# EAGLE design ESP8266 RFID Schematic (EAGLE 9.6.2)
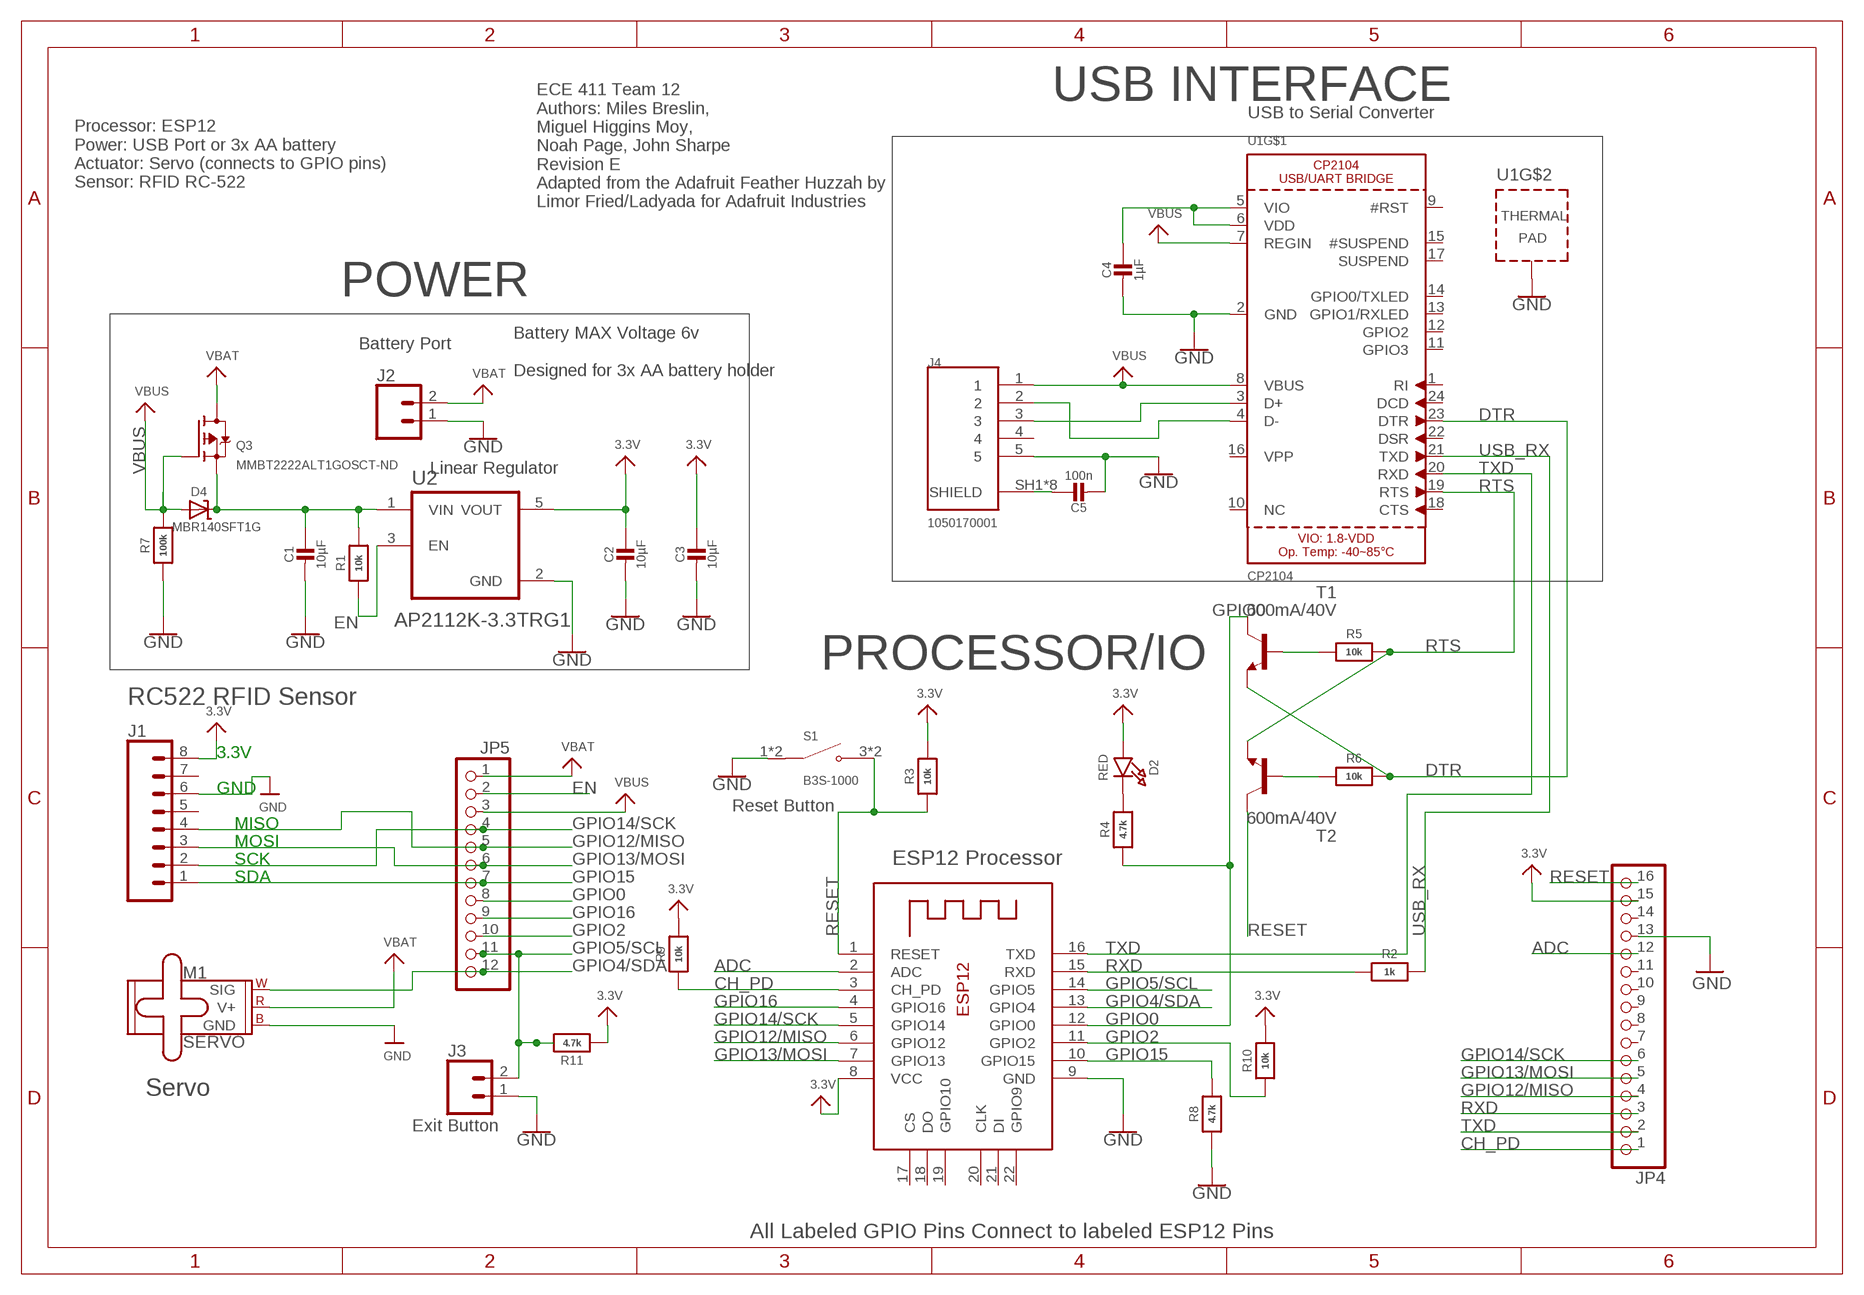
[diagram p0: schematic, sheet 1]

## Parts
C1  10µF  CAP_CERAMIC0603MINI  [0603-MINI]
C2  10µF  CAP_CERAMIC0603MINI  [0603-MINI]
C3  10µF  CAP_CERAMIC0603MINI  [0603-MINI]
C4  1µF  CAP_CERAMIC0603MINI  [0603-MINI]
C5  100n  CAP_CERAMIC0603MINI  [0603-MINI]
D2  RED  LED0603  [CHIPLED_0603]
D4  MBR140SFT1G  DIODE-SCHOTTKYSOD-123  [SOD-123]
J1  CONN_08"  [1X08]
J2  CONN_02  [1X02]
J3  CONN_02  [1X02]
J4  1050170001  [MOLEX_1050170001]
JP4  HEADER-1X16ROUND  [1X16_ROUND]
JP5  HEADER-1X12  [1X12_ROUND]
M1  SERVO  [1X03]
Q3  MMBT2222ALT1GOSCT-ND  MOSFET-P  [SOT23-R]
R1  10k  RESISTOR0603MINI  [0603-MINI]
R2  1k  RESISTOR0603MINI  [0603-MINI]
R3  10k  RESISTOR0603MINI  [0603-MINI]
R4  4.7k  RESISTOR0603MINI  [0603-MINI]
R5  10k  RESISTOR0603MINI  [0603-MINI]
R6  10k  RESISTOR0603MINI  [0603-MINI]
R7  100k  RESISTOR0603MINI  [0603-MINI]
R8  4.7k  RESISTOR0603MINI  [0603-MINI]
R9  10k  RESISTOR0603MINI  [0603-MINI]
R10  10k  RESISTOR0603MINI  [0603-MINI]
R11  4.7k  RESISTOR0603MINI  [0603-MINI]
S1  B3S-1000  [SW_B3S-1000]
T1  600mA/40V  TRANS_NPN-MMBT2222AL  [SOT23-3]
T2  600mA/40V  TRANS_NPN-MMBT2222AL  [SOT23-3]
U1  CP2104  [QFN24_4MM_SMSC]
U2  AP2112K-3.3TRG1  [SOT95P285X140-5N]
X1  ESP-12E  [ESP-12E]

## Nets
3.3V [power]: C2.1 C3.1 D2.A J1.8 JP4.15 R3.2 R9.2 R10.2 R11.1 U2.5(VOUT) X1.8(VCC)
ADC: JP4.12 X1.2(ADC)
CH_PD: JP4.1 R9.1 X1.3(CH_PD)
DTR: R6.2 T1.2(E) U1.23(DTR)
EN: JP5.2 R1.1 U2.3(EN)
GND [ground]: C1.2 C2.2 C3.2 C4.2 C5.2 J1.6 J2.1 J3.1 J4.5 JP4.13 M1.3(GND) R7.1 R8.1 S1.1(COM) S1.2(COM) U1.2(GND) U1.THERM(TP) U2.2(GND) X1.9(GND)
GPIO0: JP5.8 R4.1 T1.3(C) X1.12(GPIO0)
GPIO2: JP5.10 R10.1 X1.11(GPIO2)
GPIO4/SDA: JP5.12 M1.1(SIG) X1.13(GPIO4)
GPIO5/SCL: J3.2 JP5.11 R11.2 X1.14(GPIO5)
GPIO12/MISO: J1.4 JP4.4 JP5.5 X1.6(GPIO12)
GPIO13/MOSI: J1.3 JP4.5 JP5.6 X1.7(GPIO13)
GPIO14/SCK: J1.2 JP4.6 JP5.4 X1.5(GPIO14)
GPIO15: J1.1 JP5.7 R8.2 X1.10(GPIO15)
GPIO16: JP5.9 X1.4(GPIO16)
N$1: C5.1 J4.SH1(SHIELD) J4.SH2(SHIELD) J4.SH3(SHIELD) J4.SH4(SHIELD) J4.SH5(SHIELD) J4.SH6(SHIELD) J4.SH7(SHIELD) J4.SH8(SHIELD)
N$2: J4.3 U1.3(D+)
N$3: J4.2 U1.4(D-)
N$5: D2.C R4.2
N$6: R5.1 T1.1(B)
N$7: R6.1 T2.1(B)
N$8: C1.1 D4.C Q3.2(S) R1.2 U2.1(VIN)
N$14: C4.1 U1.5(VIO) U1.6(VDD)
RESET: JP4.16 R3.1 S1.3(NO) S1.4(NO) T2.3(C) X1.1(RESET)
RTS: R5.2 T2.2(E) U1.19(RTS)
RXD: JP4.3 R2.1 X1.15(RXD)
TXD: JP4.2 U1.20(RXD) X1.16(TXD)
USB_RX: R2.2 U1.21(TXD)
VBAT [battpower]: J2.2 JP5.1 M1.2(V+) Q3.3(D)
VBUS [power]: D4.A J4.1 JP5.3 Q3.1(G) R7.2 U1.7(REGIN) U1.8(VBUS)
Unconnected: J1.5 J1.7 J4.4 JP4.7 JP4.8 JP4.9 JP4.10 JP4.11 JP4.14 U1.1(RI) U1.9(#RST) U1.10(NC) U1.11(GPIO3) U1.12(GPIO2) U1.13(GPIO1/RXLED) U1.14(GPIO0/TXLED) U1.15(#SUSPEND) U1.16(VPP) U1.17(SUSPEND) U1.18(CTS) U1.22(DSR) U1.24(DCD) X1.17(CS) X1.18(DO) X1.19(GPIO10) X1.20(CLK) X1.21(DI) X1.22(GPIO9)

## Notes on the sheet
- USB INTERFACE
- USB to Serial Converter
- ECE 411 Team 12
  Authors: Miles Breslin, 
  Miguel Higgins Moy, 
  Noah Page, John Sharpe
  Revision E
  Adapted from the Adafruit Feather Huzzah by
  Limor Fried/Ladyada for Adafruit Industries
- Processor: ESP12
  Power: USB Port or 3x AA battery
  Actuator: Servo (connects to GPIO pins)
  Sensor: RFID RC-522
- POWER
- Battery Port
- Battery MAX Voltage 6v
  
  Designed for 3x AA battery holder
- Linear Regulator
- PROCESSOR/IO
- RC522 RFID Sensor
- 3.3V
- GND
- Reset Button
- MISO
- MOSI
- SCK | ESP12 Processor
- SDA
- Servo
- Exit Button
- All Labeled GPIO Pins Connect to labeled ESP12 Pins

## Library data of the parts
C1-C5 = microbuilder:CAP_CERAMIC: Ceramic Capacitors For new designs, use the packages preceded by an '_' character since they are more reliable: The following footprints should be used on most boards: _0402 - Standard footprint for regular board layouts _0603 - Standard footprint for regular board layouts _0805 - Standard footprint for regular board layouts _1206 - Standard footprint for regular board layouts For extremely tight-pitch boards where space is at a premium, the following 'micro-pitch' footprints can be used (smaller pads, no silkscreen outline, etc.): _0402MP - Micro-pitch footprint for very dense/compact boards _0603MP - Micro-pitch footprint for very dense/compact boards _0805MP - Micro-pitch footprint for very dense/compact boards _1206MP - Micro-pitch footprint for very dense/compact boards
D2 = microbuilder:LED: LED 0603 - 0603 Surface Mount Package 2mA: Green LED - Low Power (3.9mcd, 2ma, 1.7Vf) - Digikey: 475-2709-2-ND Orange LED - Low Power (9.8mcd, 2ma, 1.8Vf) - Digikey: 475-1194-2-ND Red LED - Low Power (5mcd, 2ma, 1.8Vf) - Digikey: 475-1195-2-ND Yellow LED - Low Power (7mcd, 2ma, 1.8Vf) - Digikey: 475-1196-2-ND 5mA: Blue LED - Low Power (17mcd, 5ma, 2.9Vf) - Digikey: LNJ937W8CRACT-ND 0805 - 0805 Surface Mount Package 2mA: Red LED (8.8mcd, 2mA, 1.8Vf, Clear) - Low Power [Digikey: 475-2510-1-ND] Green LED (5mcd, 2mA, 1.8Vf, Clear) - Low Power [Digikey: 475-2730-1-ND] Yellow LED (11.3mcd, 2mA, 1.8Vf, Clear) - Low Power [Digikey: 475-2555-1-ND] 20mA: Red LED (104mcd, 20mA, Diffused) - LS R976 [Digikey: 475-1278-6-ND] Red LED (12mcd, 20mA, 2.0Vf, Clear) - APT2012EC [Digikey: 754-1128-1-ND] Green LED (15mcd, 20mA, 2.2Vf, Clear) - APT2012GC [Digikey: 754-1131-1-ND] Orange LED (160mcd, 20mA, 2.1Vf, Clear) - APT2012SECK [Digikey: 754-1130-1-ND] 1206 - 1206 Surface Mount Package Green LED (26mcd, 20mA, Diffused) - LG N971 [Digikey: 475-1407-6-ND] Red LED (15mcd, 20mA, Diffused) - LH N974 [Digikey: 475-1416-6-ND] Cree - Cree High-Power Surface Mount LEDs XPEBWT-L1-0000-00D50 - White 111lm 350mA 2.9Vf 6200K 110° XTEAWT-00-0000-00000LEE3 - White 114lm 350mA 2.85Vf 5000K 115° Everlight - Everlight 45-21 Series Surface Mount LEDs 45-21/QK2C-B2832AC2CB2/2T - Warm White 2000mcd 20mA 3.25Vf 3050K 120° 45-21/LK2C-B38452C4CB2/2T - Nuetral White 2000mcd 20mA 3.25Vf 4150K 120° 45-21/LK2C-B50634C6CB2/2T - Cold White 2200mcd 20mA 3.25Vf 5650K 120° PLCC2 Reverse Mount LS T77K-J1L2-1-0-2-R18-Z - Red 11.25mcd 2mA 1.8Vf 630nm 120° LO T77K-L1M2-24-Z - Orange 19.6mcd 2mA 1.8Vf 606nm 120° LY T77K-K2M1-26-Z - Yellow 15.7mcd 2mA 1.8Vf 587nm 120°
D4 = microbuilder:DIODE-SCHOTTKY
J1 = SparkFun-Connectors:CONN_08: Multi connection point. Often used as Generic Header-pin footprint for 0.1 inch spaced/style header connections On any of the 0.1 inch spaced packages, you can populate with these: Break Away Headers - Straight <https://www.sparkfun.com/products/116> (PRT-00116) Break Away Male Headers - Right Angle <https://www.sparkfun.com/products/553> (PRT-00553) Female Headers <https://www.sparkfun.com/products/115> (PRT-00115) Break Away Headers - Machine Pin <https://www.sparkfun.com/products/117> (PRT-00117) Break Away Female Headers - Swiss Machine Pin <https://www.sparkfun.com/products/743> (PRT-00743) Arduino Stackable Header - 8 Pin <https://www.sparkfun.com/products/9279> (PRT-09279) For SCREWTERMINALS and SPRING TERMINALS visit here: Screw Terimnals on SparkFun.com <https://www.sparkfun.com/search/results?term=Screw+Terminals> (5mm/3.5mm/2.54mm spacing) This device is also useful as a general connection point to wire up your design to another part of your project. Our various solder wires solder well into these plated through hole pads. Hook-Up Wire - Assortment (Stranded, 22 AWG) <https://www.sparkfun.com/products/11375> (PRT-11375) Hook-Up Wire - Assortment (Solid Core, 22 AWG) <https://www.sparkfun.com/products/11367> (PRT-11367) View the entire wire category on our website here <https://www.sparkfun.com/categories/141> Special notes: Molex polarized connector foot print use with SKU : PRT-08231 with associated crimp pins and housings. 1MM SMD Version SKU: PRT-10208 NOTES ON THE VARIANTS LOCK and LOCK_LONGPADS... This footprint was designed to help hold the alignment of a through-hole component (i.e. 6-pin header) while soldering it into place. You may notice that each hole has been shifted either up or down by 0.005 of an inch from it's more standard position (which is a perfectly straight line). This slight alteration caused the pins (the squares in the middle) to touch the edges of the holes. Because they are alternating, it causes a "brace" to hold the component in place. 0.005 has proven to be the perfect amount of "off-center" position when using our standard breakaway headers. Although looks a little odd when you look at the bare footprint, once you have a header in there, the alteration is very hard to notice. Also,if you push a header all the way into place, it is covered up entirely on the bottom side.; PROD_ID: CONN-08438
J2 J3 = SparkFun-Connectors:CONN_02: Multi connection point. Often used as Generic Header-pin footprint for 0.1 inch spaced/style header connections On any of the 0.1 inch spaced packages, you can populate with these: Break Away Headers - Straight <https://www.sparkfun.com/products/116> (PRT-00116) Break Away Male Headers - Right Angle <https://www.sparkfun.com/products/553> (PRT-00553) Female Headers <https://www.sparkfun.com/products/115> (PRT-00115) Break Away Headers - Machine Pin <https://www.sparkfun.com/products/117> (PRT-00117) Break Away Female Headers - Swiss Machine Pin <https://www.sparkfun.com/products/743> (PRT-00743) For SCREWTERMINALS and SPRING TERMINALS visit here: Screw Terimnals on SparkFun.com <https://www.sparkfun.com/search/results?term=Screw+Terminals> (5mm/3.5mm/2.54mm spacing) This device is also useful as a general connection point to wire up your design to another part of your project. Our various solder wires solder well into these plated through hole pads. Hook-Up Wire - Assortment (Stranded, 22 AWG) <https://www.sparkfun.com/products/11375> (PRT-11375) Hook-Up Wire - Assortment (Solid Core, 22 AWG) <https://www.sparkfun.com/products/11367> (PRT-11367) View the entire wire category on our website here <https://www.sparkfun.com/categories/141> Special notes: Molex polarized connector foot print use with: PRT-08233 with associated crimp pins and housings. 2.54_SCREWTERM for use with PRT-10571. 3.5mm Screw Terminal footprints for PRT-08084 5mm Screw Terminal footprints for use with PRT-08432
J4 = 1050170001:1050170001: Conn.; Data; USB; Recept.; Micro; B Type; Bottom Mount, SMT, with Solder Tabs, Lead-Free; DESCRIPTION: USB - micro B USB 2.0 Receptacle Connector 5 Position Surface Mount, Right Angle; Through Hole; DIGI-KEY_PART_NUMBER: WM1399CT-ND; MF: Molex; MP: 1050170001; PACKAGE: None; PURCHASE-URL: https://pricing.snapeda.com/search/part/1050170001/?ref=eda
JP4 = microbuilder:HEADER-1X16: PIN HEADER
JP5 = microbuilder:HEADER-1X12
M1 = SparkFun-Electromechanical:SERVO: Servo Motor 3-pin connector for a standard servo motor (voltage supply, ground, and control signal.) SparkFun Products Servo - Generic (Sub-Micro Size) <https://www.sparkfun.com/products/9065> (ROB-09065) Servo - Generic High Torque Continuous Rotation (Standard Size) <https://www.sparkfun.com/products/9347> (ROB-09347) Servo - Generic High Torque (Standard Size) <https://www.sparkfun.com/products/11965> (ROB-11965)
Q3 = microbuilder:MOSFET-P: P-Channel Mosfet LEGEND VDS: Voltage Drain-Source ID: Drain Current RDS(ON): Drain-Source On-State Resistance VGS(TH): Gate-Source Threshold Voltage CISS: Drain-Source Input Capacitance SOT-23 Name VDS ID RDS(ON) VGS(TH) CISS Order Number IRLML5103 30V 760mA 600 mOhm -- 75pF @ 25V Digikey: IRLML5103PBFCT-ND IRLML6401 12V 4.3A 50 mOhm 950mV @ 250µA 830pF @ 10V Digikey: IRLML6401PBFTR-ND NTR0202PL 20V 400mA 800 mOhm 2.3V @ 250uA 70pF @ 5V Digikey: NTR0202PLT1GOSTR-ND NTR4101PT1G 20V 1.8A 85 mOhm 1.2V @ 250uA 675pF @ 10V Digikey: NTR4101PT1GOSCT-ND DMP2004K 20V 600mA 900 mOhm 1V @ 250uA 175pF @ 16V Digikey: DMP2004KDICT-ND PMV65XP 20V 3.9A 76 mOhm 950mV @ 1mA 725pF @ 20V Digikey: 568-2358-2-ND TO-252 Name VDS ID RDS(ON) VGS(TH) CISS Order Number AOD417 30V 25A 34 mOhm 3V @ 250µA 920pF @ 15V Digikey: 785-1106-2-ND PowerPak Name VDS ID RDS(ON) VGS(TH) CISS Order Number AON7401 30V 12A 14 mOhm 3V @ 250µA 2600pF @ 15V Digikey: 785-1302-1-ND
R1-R11 = microbuilder:RESISTOR: Resistors For new designs, use the packages preceded by an '_' character since they are more reliable: The following footprints should be used on most boards: _0402 - Standard footprint for regular board layouts _0603 - Standard footprint for regular board layouts _0805 - Standard footprint for regular board layouts _1206 - Standard footprint for regular board layouts For extremely tight-pitch boards where space is at a premium, the following 'micro-pitch' footprints can be used (smaller pads, no silkscreen outline, etc.): _0402MP - Micro-pitch footprint for very dense/compact boards _0603MP - Micro-pitch footprint for very dense/compact boards _0805MP - Micro-pitch footprint for very dense/compact boards _1206MP - Micro-pitch footprint for very dense/compact boards
S1 = B3S-1000:B3S-1000: Tactile Switch SPST-NO Top Actuated Surface Mount; DESCRIPTION: Tactile Switch SPST-NO Top Actuated Surface Mount; DIGI-KEY_PART_NUMBER: SW836TR-ND; MF: Omron; MP: B3S-1000; PACKAGE: None; PURCHASE-URL: https://pricing.snapeda.com/search/part/B3S-1000/?ref=eda
T1 T2 = SparkFun-DiscreteSemi:TRANS_NPN: NPN transistor Current controlled devices typically used to amplify current or used as a switch. BC547 - COM-08928 <http://www.sparkfun.com/products/8928> (TO-92 45V 100mA) (1.Collector 2.Base 3.Emitter) 2N3904 - COM-00521 <http://www.sparkfun.com/products/521> (TO-92 40V 200mA) (1.Emitter 2.Base 3.Collector) P2N2222A - COM-12852 <http://www.sparkfun.com/products/12852> (TO-92 40V 600mA) (1.Collector 2.Base 3.Emitter); PROD_ID: TRANS-08049
U1 = microbuilder:CP2104: CP2104 - USB to UART Bridge VDD Output: 3.45V
U2 = AP2112K-3.3TRG1:AP2112K-3.3TRG1: AP2112 Series 0.6 A 3.3 V Fixed Output SMT LDO Linear Regulator - SOT23-5; DESCRIPTION: Linear Voltage Regulator IC 1 Output 600mA SOT-25; DIGI-KEY_PART_NUMBER: AP2112K-3.3TRG1DICT-ND; MF: Diodes Inc.; MP: AP2112K-3.3TRG1; PACKAGE: SOT-753 Diodes Inc.; PURCHASE-URL: https://pricing.snapeda.com/search/part/AP2112K-3.3TRG1/?ref=eda
X1 = microbuilder:ESP-12E

## Net classes
0 default: width 0.305 mm
1 power: width 0.508 mm
2 ground: width 0.305 mm
3 battpower: width 1.27 mm

## Board
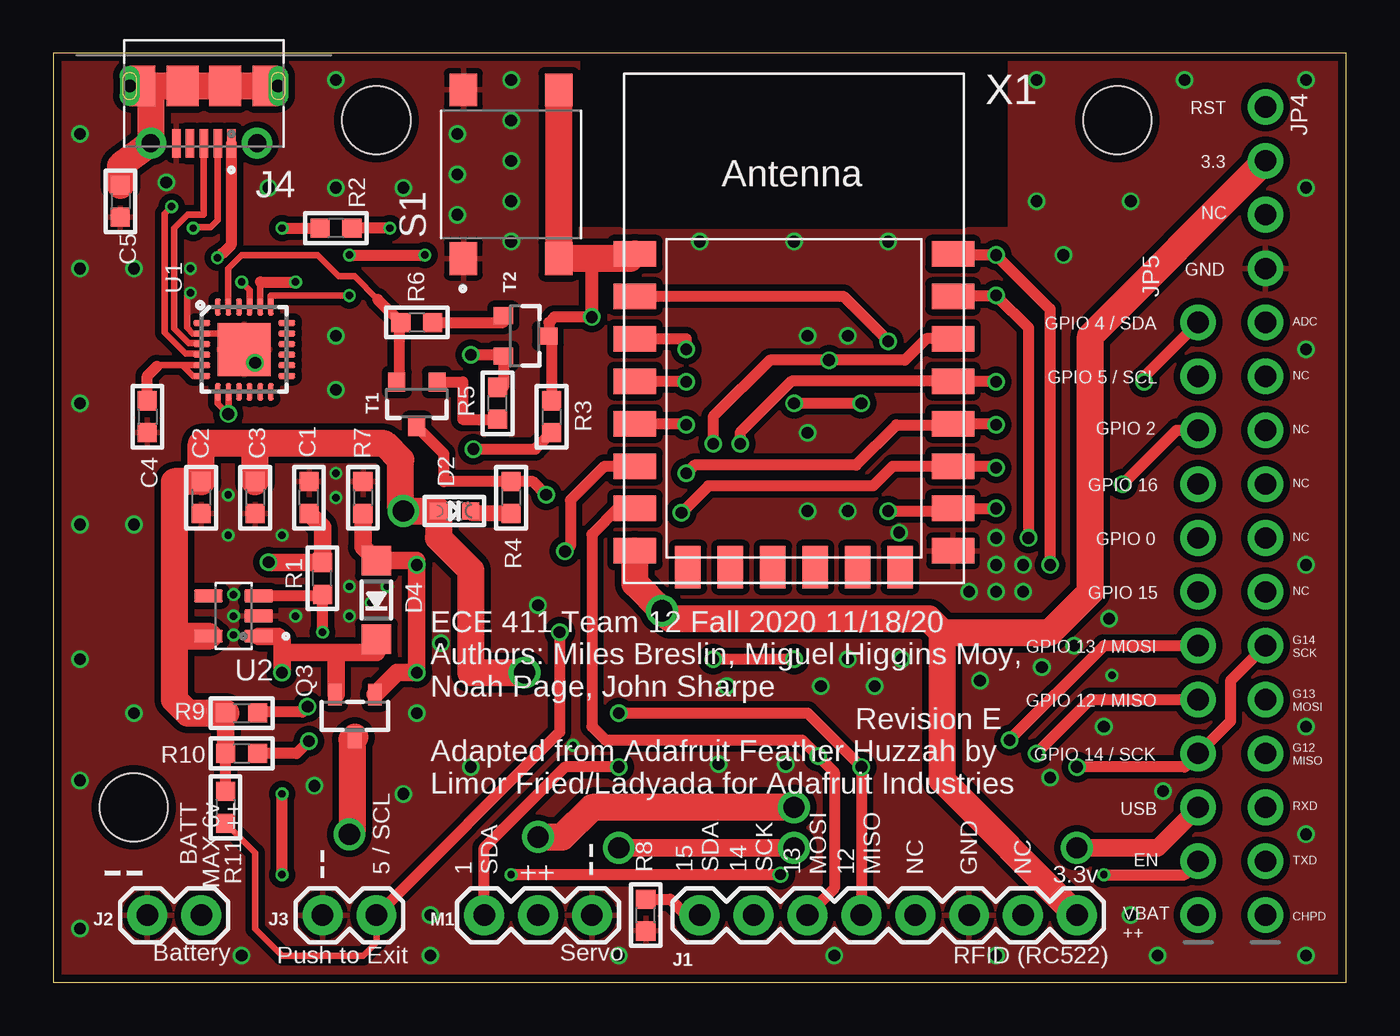
[diagram p1: board, top side]
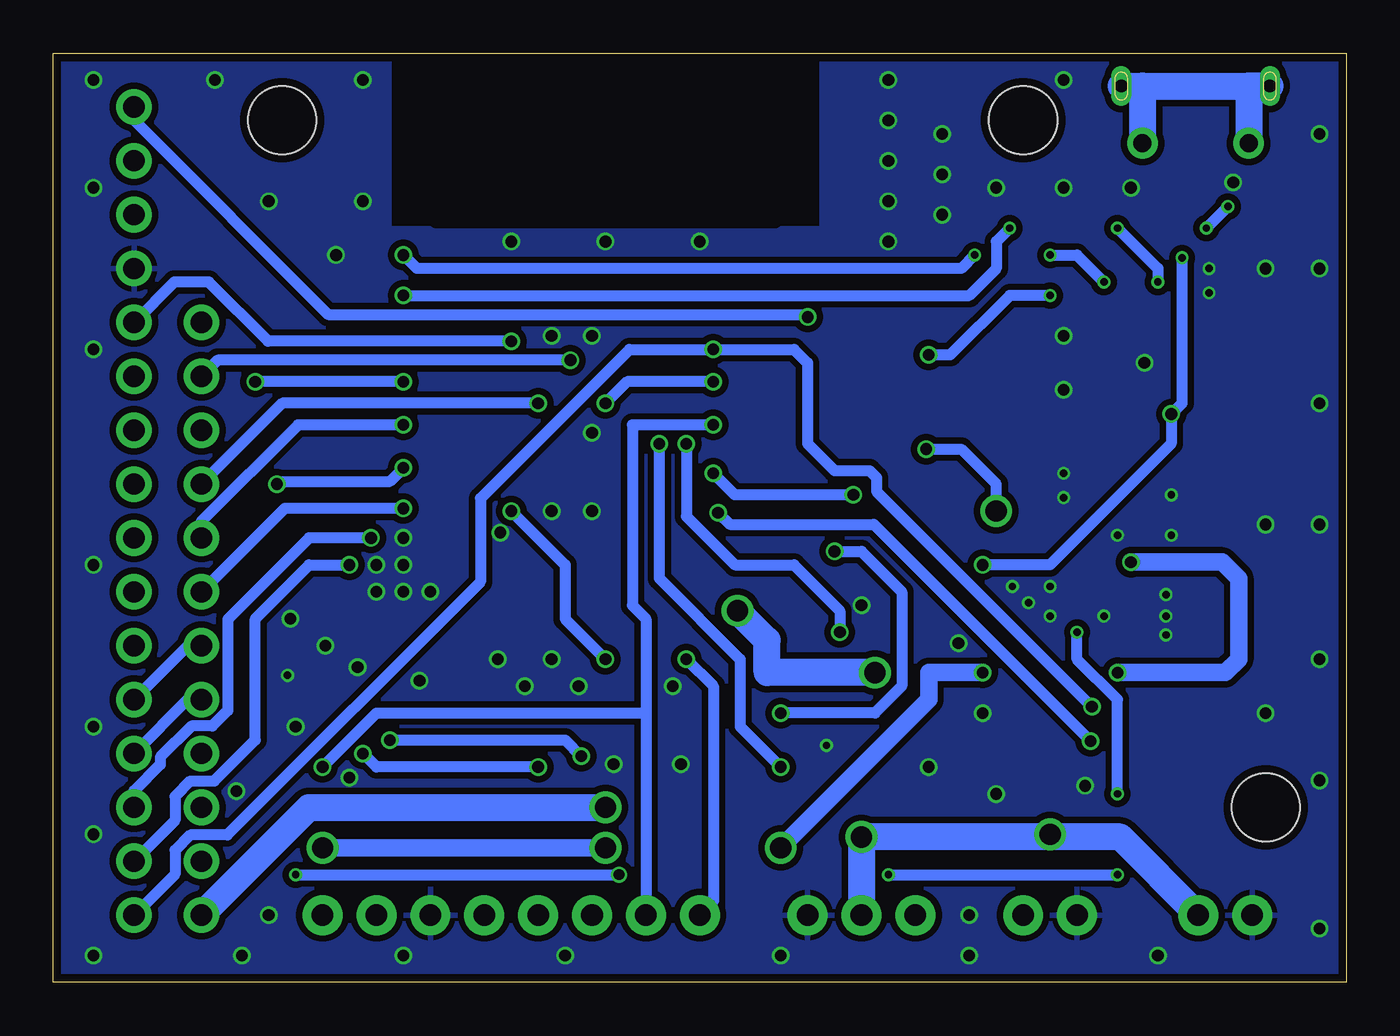
[diagram p2: board, bottom side, seen from below]

Size 60.97 x 43.82 mm. Coordinates in mm from the lower left corner, seen from the top.
Outline: 0,0 60.97,0 60.97,43.81 0,43.81 0,0
Copper layers (1*16): Top 0.035559375mm / dielectric 1.6mm / Bottom 0.035559375mm
Design rules "oshpark-2layer *": minimum track width 6mil, minimum drill 10mil, track to track 6mil, track to pad 6mil, pad to pad 6mil, via to via 6mil, smd to smd 6mil, copper to edge 15mil, drill to drill 6mil, minimum pad ring 5mil, minimum via ring 5mil, stop-mask expansion 2.5mil, vias tented up to drill 0mil, thermal gap 10mil
Holes 3.2 mm at 15.24,40.64 50.16,40.64 3.81,8.26

### Footprints (pad centres in the part's own frame; a part is rotated, then mirrored left to right if it is on the bottom)
0603-MINI = smd 0.9 x 0.9: 1 -0.75,0; 2 0.75,0
CHIPLED_0603 = smd 0.8 x 0.8: A 0,-0.75; C 0,0.75
SOD-123 = smd 1.4 x 1.4: A 1.85,0; C -1.85,0
1X08 = drill 1.016 pad 1.88: 1 0,0; 2 2.54,0; 3 5.08,0; 4 7.62,0; 5 10.16,0; 6 12.7,0; 7 15.24,0; 8 17.78,0
1X02 = drill 1.016 pad 1.88: 1 0,0; 2 2.54,0
MOLEX_1050170001 = smd 0.4 x 1.35: 1 -1.3,2.35; 2 -0.65,2.35; 3 0,2.35; 4 0.65,2.35; 5 1.3,2.35 | drill 0.85 pad 1.45: SH1 -2.5,2.35; SH2 2.5,2.35 | drill 0.6 pad 0.95 long: SH3 -3.5,-0.35; SH8 3.5,-0.35 | smd 1.2 x 1.9: SH4 -2.9,-0.35; SH7 2.9,-0.35 | smd 1.5 x 1.9: SH5 -1,-0.35; SH6 1,-0.35
1X16_ROUND = drill 1 pad 1.676: 1 -19.05,0; 2 -16.51,0; 3 -13.97,0; 4 -11.43,0; 5 -8.89,0; 6 -6.35,0; 7 -3.81,0; 8 -1.27,0; 9 1.27,0; 10 3.81,0; 11 6.35,0; 12 8.89,0; 13 11.43,0; 14 13.97,0; 15 16.51,0; 16 19.05,0
1X12_ROUND = drill 1 pad 1.676: 1 -13.97,0; 2 -11.43,0; 3 -8.89,0; 4 -6.35,0; 5 -3.81,0; 6 -1.27,0; 7 1.27,0; 8 3.81,0; 9 6.35,0; 10 8.89,0; 11 11.43,0; 12 13.97,0
1X03 = drill 1.016 pad 1.88: 1 0,0; 2 2.54,0; 3 5.08,0
SOT23-R = smd 0.635 x 1.016: 1 -0.95,-1; 2 0.95,-1; 3 0,1
SW_B3S-1000 = smd 1.55 x 1.3: 1 -3.975,2.25; 2 3.975,2.25; 3 -3.975,-2.25; 4 3.975,-2.25
SOT23-3 = smd 0.8 x 0.9: 1 -0.95,-1; 2 0.95,-1; 3 0,1.1
QFN24_4MM_SMSC = smd 0.8 x 0.28: 1 -2,1.25; 2 -2,0.75; 3 -2,0.25; 4 -2,-0.25; 5 -2,-0.75; 6 -2,-1.25; 13 2,-1.25; 14 2,-0.75; 15 2,-0.25; 16 2,0.25; 17 2,0.75; 18 2,1.25 | smd 0.28 x 0.8: 7 -1.25,-2; 8 -0.75,-2; 9 -0.25,-2; 10 0.25,-2; 11 0.75,-2; 12 1.25,-2; 19 1.25,2; 20 0.75,2; 21 0.25,2; 22 -0.25,2; 23 -0.75,2; 24 -1.25,2 | smd 2.5 x 2.5: THERM 0,0
SOT95P285X140-5N = smd 1.35 x 0.6: 1 -1.185,0.95; 2 -1.185,0; 3 -1.185,-0.95; 4 1.185,-0.95; 5 1.185,0.95
ESP-12E = smd 2 x 1.2: 1 -7.5,5.77; 2 -7.5,3.77; 3 -7.5,1.77; 4 -7.5,-0.23; 5 -7.5,-2.23; 6 -7.5,-4.23; 7 -7.5,-6.23; 8 -7.5,-8.23; 9 7.5,-8.23; 10 7.5,-6.23; 11 7.5,-4.23; 12 7.5,-2.23; 13 7.5,-0.23; 14 7.5,1.77; 15 7.5,3.77; 16 7.5,5.77 | smd 1.2 x 2: 17 -5,-9; 18 -3,-9; 19 -1,-9; 20 1,-9; 21 3,-9; 22 5,-9

### Placement (x,y rotation side)
C1  12.06,22.86 90 top
C2  6.99,22.86 270 top
C3  9.53,22.86 270 top
C4  4.45,26.67 270 top
C5  3.17,36.83 270 top
D2  18.92,22.23 270 top
D4  15.24,18.03 90 top
J1  30.48,3.17 0 top
J2  4.45,3.17 0 top
J3  12.7,3.17 0 top
J4  7.11,41.91 180 top
JP4  57.15,22.23 90 top
JP5  53.98,17.14 90 top
M1  20.32,3.17 0 top
Q3  14.22,12.57 180 top
R1  12.7,19.05 90 top
R2  13.34,35.56 180 top
R3  23.5,26.67 270 top
R4  21.59,22.86 270 top
R5  20.95,27.3 90 top
R6  17.14,31.11 180 top
R7  14.61,22.86 270 top
R8  27.94,3.17 90 top
R9  8.89,12.7 180 top
R10  8.89,10.79 180 top
R11  8.13,8.26 270 top
S1  21.59,38.1 90 top
T1  17.14,27.3 180 top
T2  22.23,30.48 270 top
U1  9.02,29.84 0 top
U2  8.51,17.27 180 top
X1  34.92,28.57 0 top

### Tracks (layer width: path | path; a pad name or v marks a point on that pad's centre or on a via)
3.3V  (via drill 0.55, 1)
  Top 0.508: R3.2 22.72,25.15 v19.81,25.15 | R11.1 8.13,10.78 R10.2
  Top 0.813: v16.51,22.23 16.38,22.35 | R9.2 R10.2
  Top 1.27: v16.51,22.23 D2.A 18.17,20.95 19.68,19.44 19.68,14.61 v22.23,14.61 | 16.38,22.35 16.38,24.64 15.62,25.4 9.53,25.4 | C3.1 9.53,25.4 | 9.53,25.4 6.99,25.4 C2.1 5.71,23.61 5.71,16.51 | 5.71,16.51 5.71,13.34 6.35,12.7 R9.2 | J1.8 41.91,9.53 41.91,16.51 | 41.91,16.51 41.27,17.14 29.08,17.14 v28.7,17.53 27.43,18.8 X1.8 | 41.91,16.51 46.99,16.51 48.9,18.41 48.9,30.48 JP4.15 | U2.5 5.9,16.32 5.71,16.51
  Bottom 0.508: v19.81,25.15 18.16,25.15 16.51,23.5 v16.51,22.23
  Bottom 1.27: v22.23,14.61 27.3,14.61 27.3,16.13 v28.7,17.53
ADC  (via drill 0.55)
  Top 0.508: X1.2 37.25,32.34 v39.37,30.23
  Bottom 0.508: v39.37,30.23 50.83,30.23 53.62,33.02 55.24,33.02 JP4.12
CH_PD  (via drill 0.55)
  Top 0.508: X1.3 29.84,30.34 v29.84,29.84 | R9.1 9.69,12.75 11.75,12.75 v12,13
  Bottom 0.508: JP4.1 55.22,5.11 55.22,6.23 54.49,6.96 52.75,6.96 40.82,18.88 40.82,22.82 33.8,29.84 v29.84,29.84 26.04,29.84 25.4,29.21 25.4,25.4 24.13,24.13 22.48,24.13 22.15,23.8 22.15,23.15 v12,13
DTR
  Top 0.305: U1.23 8.26,31.84 8.26,33.66 8.89,34.29 12.48,34.29 13.46,33.3 14.21,33.3 15.31,32.2 | T1.2 16.32,28.43 | R6.2 16.32,31.04
  Top 0.508: 15.31,32.2 R6.2 | 16.32,31.04 16.32,28.43
EN  (via drill 0.35, 0.5)
  Top 0.508: v34.29,5.08 v21.59,5.08 | v10.79,5.08 v10.79,8.89 | JP5.2 53.34,5.08 v49.53,5.08 | v12.7,16.51 R1.1 12.62,18.22 U2.3
  Bottom 0.508: v49.53,5.08 v34.29,5.08 | v21.59,5.08 v10.79,5.08 | v10.79,8.89 10.79,13.34 12.7,15.24 v12.7,16.51
GND  (via drill 0.35, 0.55)
  Top 0.305: v6.48,32.51 6.31,32.35 6.31,30.87 6.59,30.59 U1.2 8.78,30.59 9.02,30.35 U1.THERM
  other vias: 3.81,12.7 17.78,3.17 16.51,8.89 17.14,12.7 19.68,10.16 3.81,21.59 13.34,27.94 13.34,30.48 13.34,37.47 21.59,36.83 21.59,38.73 34.92,34.92 46.35,36.83 47.62,34.29 50.8,36.83 59.05,37.47 59.05,29.84 59.05,19.68 59.05,6.99 50.8,3.17 1.27,33.66 1.27,27.3 1.27,21.59 1.27,40.01 13.34,42.55 21.59,42.55 21.59,40.64 30.48,34.92 39.37,34.92 46.35,42.55 53.34,42.55 59.05,42.55 59.05,12.06 52.07,1.27 44.45,1.27 36.83,1.27 26.67,1.27 17.78,1.27 8.89,1.27 1.27,2.54 1.27,9.53 1.27,15.24 40.01,15.24 46.61,14.86 22.86,17.78 59.05,1.27 35.56,30.48 37.47,30.48 35.56,25.91 35.56,22.23 37.47,22.23 44.45,20.95 44.45,19.68 45.72,19.68 45.72,18.41 44.45,18.41 43.18,18.41 39.88,21.21 6.48,33.66 49.78,17.14 48.13,15.88 43.69,14.22 52.32,9.02 46.99,9.65 9.53,29.21 34.54,10.29 31.37,10.29 24.51,11.18 31.75,13.97 36.2,13.97 38.73,13.97 37.47,15.24 49.53,12.06 12.32,9.27 13.97,18.67 13.34,22.86 10.79,21.08 8.51,17.27 49.91,14.48 18.29,16 5.33,37.72 3.81,33.66 10.16,37.47 19.05,40.01 19.05,38.1 19.05,36.2 21.59,34.92 16.51,37.47 11.43,17.27 13.97,17.27 15.75,18.67 14.99,17.91 13.34,24 8.51,16.38 8.51,18.29 8.26,22.99 8.26,21.08
  pour Bottom (isolate 0.305): 0,43.81 24.77,43.81 24.77,35.56 45.09,35.56 45.09,43.81 60.96,43.81 60.96,0 0,0
  pour Top (isolate 0.305): 0,43.81 24.77,43.81 24.77,35.56 45.09,35.56 45.09,43.81 60.96,43.81 60.96,0 0,0
GPIO0  (via drill 0.55)
  Top 0.508: T1.3 18.41,24.93 18.41,23.61 R4.1 22.62,23.61 v23.24,22.99 | X1.12 42.55,26.34 | 42.55,26.34 44.39,26.34 v44.45,26.29 | 42.55,26.34 42.49,26.29 39.75,26.29 37.85,24.38 30.23,24.38 v29.84,24
  Bottom 0.508: v23.24,22.99 28.83,22.99 v29.84,24 | v44.45,26.29 49.42,26.29 53.98,21.73 JP5.8
GPIO2  (via drill 0.55)
  Top 0.508: v44.45,24.26 44.36,24.34 X1.11 39.59,24.34 38.65,23.41 30.89,23.41 v29.62,22.14 | v50.42,23.5 52.96,26.04 JP5.10 | v12.06,11.37 11.48,10.79 R10.1
  Bottom 0.508: v44.45,24.26 45.09,23.62 50.42,23.62 v50.42,23.5 | v29.62,22.14 29.07,21.59 22.27,21.59 v12.06,11.37
GPIO4/SDA  (via drill 0.55)
  Top 0.508: v26.67,10.16 24.13,10.16 20.32,6.35 M1.1 | v44.45,28.32 44.43,28.34 X1.13 34.81,28.34 32.38,25.92 v32.38,25.4 | v51.44,28.32 51.44,28.57 JP5.12
  Bottom 0.508: v32.38,25.4 32.38,19.05 28.57,15.24 28.57,12.06 v26.67,10.16 | v44.45,28.32 v51.44,28.32
GPIO5/SCL  (via drill 0.55)
  Top 0.305: R11.2 9.53,6.11 9.53,2.54 10.79,1.27 14.61,1.27 15.24,1.91 J3.2
  Top 0.508: J3.2 23.88,11.81 v23.88,16.51 | X1.14 41.16,30.34 40.15,29.34 v36.58,29.34 33.78,29.34 31.11,26.67 v31.11,25.4
  Bottom 0.508: v31.11,25.4 31.11,21.97 28.83,19.68 26.04,19.68 23.88,17.53 v23.88,16.51 | v36.58,29.34 53.21,29.34 JP5.11
GPIO12/MISO  (via drill 0.55)
  Top 0.508: J1.4 v38.1,10.16 35.56,12.7 v26.67,12.7 | v46.35,10.79 48.9,13.34 JP5.5 | v24.13,20.32 24.38,20.57 24.38,22.73 26,24.34 X1.6
  Bottom 0.508: v24.13,20.32 22.86,20.32 20.95,18.41 20.95,13.97 22.23,12.7 v26.67,12.7 | JP5.5 54.61,13.34 JP4.4 | v38.1,10.16 45.72,10.16 v46.35,10.79
GPIO13/MOSI  (via drill 0.55)
  Top 0.508: J1.3 36.83,4.45 36.83,9.91 v36.07,10.67 35.31,11.43 26.04,11.43 25.4,12.06 25.4,21.13 26.64,22.37 27.4,22.37 X1.7 | JP5.6 49.53,15.88 v45.09,11.43
  Bottom 0.508: JP5.6 54.61,15.88 JP4.5 | v36.07,10.67 36.83,11.43 v45.09,11.43
GPIO14/SCK  (via drill 0.55)
  Top 0.508: X1.5 29.84,26.34 v29.84,26.29 | JP4.6 55.5,14.22 55.5,12.32 JP5.4 53.34,10.16 v48.26,10.16
  Bottom 0.508: v29.84,26.29 33.66,26.29 33.66,17.78 33.02,17.14 33.02,12.7 | 33.02,12.7 J1.2 | 33.02,12.7 45.72,12.7 v48.26,10.16
GPIO15  (via drill 0.55)
  Top 0.508: v34.92,15.24 v31.11,15.24 | v39.37,22.23 42.42,22.23 X1.10 v44.45,22.34 | R8.2 29.09,3.92 29.84,3.17 J1.1
  Bottom 0.508: v31.11,15.24 29.84,13.97 29.84,3.81 J1.1 | v39.37,22.23 36.83,19.68 36.83,17.14 v34.92,15.24 | v44.45,22.34 50.05,22.34 JP5.7
GPIO16  (via drill 0.55)
  Top 0.508: X1.4 29.84,28.34 v29.84,28.32 | v34.92,27.3 v38.1,27.3
  Bottom 0.508: v29.84,28.32 33.91,28.32 v34.92,27.3 | v38.1,27.3 50.16,27.3 JP5.9
N$1
  Top 1.27: J4.SH4 J4.SH5 J4.SH6 J4.SH7 4.59,41.88 4.59,39.58 J4.SH2 3.17,38.5 C5.1
  Bottom 1.27: J4.SH1 9.61,42.26 J4.SH3 J4.SH8 4.61,42.26 J4.SH2
N$2
  Top 0.305: U1.3 6.97,30.14 6.4,30.14 5.71,30.82 5.71,35.56 6.35,36.2 7.11,36.2 J4.3
N$3  (via drill 0.35)
  Top 0.305: v6.6,35.56 6.66,35.61 7.43,35.61 7.76,35.94 J4.2 | v5.59,36.58 5.26,36.25 5.26,30.63 6.25,29.64 6.97,29.64 U1.4
  Bottom 0.508: v6.6,35.56 v5.59,36.58
N$5
  Top 0.762: R4.2 19.79,22.11 D2.C
N$6
  Top 0.305: R5.1
  Top 0.508: T1.1 19.3,28.3 19.3,26.54 R5.1
N$7
  Top 0.508: R6.1 21.23,31.11 T2.1
N$8  (via drill 0.55)
  Top 0.305: Q3.2 13.34,13.57 | v10.16,19.81 v10.16,19.8
  Top 0.813: C1.1 12.7,21.48 R1.2 v10.16,19.8 | 13.34,15.56 15.24,15.56 D4.C | 13.34,13.57 13.34,15.56 | U2.1 10.6,16.32 10.79,16.13 10.79,15.37 | 10.79,15.37 v10.79,14.61 | 13.34,15.56 10.99,15.56 10.79,15.37
  Bottom 0.813: v10.79,14.61 5.71,14.61 5.08,15.24 5.08,19.05 5.84,19.81 v10.16,19.81
N$14
  Top 0.305: U1.5 6.1,29.09 | 6.1,29.09 4.95,29.09 4.89,29.04 | U1.6 6.6,28.59 6.1,29.09
  Top 0.508: C4.1 4.45,28.59 4.89,29.04
RESET  (via drill 0.55)
  Top 0.305: 23.37,30.48 T2.3 23.5,30.48
  Top 0.508: 23.37,30.48 23.37,31.11 23.62,31.37 v25.4,31.37 | 23.5,30.48 R3.1
  Top 0.61: v25.4,31.37 25.4,34.12
  Top 1.27: X1.1 27.2,34.12 25.4,34.12 S1.3 S1.4
  Bottom 0.508: v25.4,31.37 25.53,31.5 48.01,31.5 57.15,40.64 JP4.16
RTS  (via drill 0.35, 0.55)
  Top 0.305: U1.19 10.27,32.38 v13.97,32.38 | 21.23,29.59 T2.2 | 21.23,28.05 R5.2
  Top 0.508: v19.68,29.59 21.23,29.59 | T2.2 21.23,28.05
  Bottom 0.508: v13.97,32.38 15.88,32.38 18.67,29.59 v19.68,29.59
RXD  (via drill 0.35, 0.55)
  Top 0.305: v44.45,32.38 44.45,32.34
  Top 0.508: v15.88,35.56 R2.1 | 44.45,32.34 X1.15 | v44.45,32.38 45.97,30.86 v45.97,20.95
  Bottom 0.508: v44.45,32.38 17.78,32.38 16.51,33.66 16.51,34.92 v15.88,35.56 | v45.97,20.95 48.9,20.95 52.73,17.12 52.73,12.82 53.46,12.09 54.44,12.09 55.91,10.62 55.91,10.28 57.15,9.04 JP4.3
TXD  (via drill 0.35, 0.55)
  Top 0.305: U1.20 9.77,33.02 | 42.42,34.29 X1.16
  Top 0.508: 9.77,33.02 v11.43,33.02 | 42.42,34.29 v44.45,34.29 46.99,31.75 v46.99,19.68 | v13.97,34.29 v17.53,34.29
  Bottom 0.508: v13.97,34.29 12.7,34.29 v11.43,33.02 | v17.53,34.29 18.16,33.66 43.81,33.66 v44.45,34.29 | JP4.2 55.22,7.64 55.22,8.77 54.49,9.5 53.37,9.5 51.44,11.43 51.44,17.14 48.9,19.68 v46.99,19.68
USB_RX  (via drill 0.35)
  Top 0.305: v8.89,33.02 9.27,32.64 U1.21
  Top 0.508: v10.79,35.56 R2.2
  Bottom 0.508: v10.79,35.56 8.89,33.66 v8.89,33.02
VBAT  (via drill 1)
  Top 1.27: v22.86,6.86 24,6.86 25.4,8.26 v34.92,8.26 | v13.97,6.99 14.1,7.11 14.1,11.45 Q3.3
  Bottom 1.27: J2.2 10.67,6.86 13.97,6.86 | 13.97,6.86 v22.86,6.86 M1.2 | v34.92,8.26 48.9,8.26 JP5.1 | v13.97,6.99 13.97,6.86
VBUS  (via drill 0.35, 0.55, 1)
  Top 0.305: U1.8 v8.27,26.81 v8.27,26.8 7.77,27.3 U1.7
  Top 0.508: v7.75,34.16 7.95,34.37 7.99,34.37 8.41,34.78 J4.1 | v8.27,26.81 v8.26,26.8
  Top 0.813: R7.2 14.61,20.52 D4.A 17.14,19.88 v17.14,19.68 v17.14,14.61 16.21,14.61 Q3.1 | JP5.3 52.07,6.35 v48.26,6.35 | v34.92,6.35 v26.67,6.35
  Bottom 0.508: v7.75,34.16 7.75,27.3 v8.26,26.8 8.26,25.4 13.97,19.68 v17.14,19.68
  Bottom 0.813: v48.26,6.35 v34.92,6.35 | v26.67,6.35 19.68,13.34 19.68,14.61 v17.14,14.61

### Text on the board
tPlace: RST | 3.3 | NC | GND | GPIO 4 / SDA | ADC | NC | GPIO 5 / SCL | GPIO 2 | NC | NC | GPIO 16 | GPIO 0 | NC | NC | GPIO 15 | GPIO 13 / MOSI | G14 / SCK | GPIO 12 / MISO | G13 / MOSI | GPIO 14 / SCK | G12 / MISO | BATT / MAX 6v / ++ | ECE 411 Team 12 Fall 2020 11/18/20 / Authors: Miles Breslin, Miguel Higgins Moy, / Noah Page, John Sharpe / Revision E / Adapted from Adafruit Feather Huzzah by / Limor Fried/Ladyada for Adafruit Industries | USB | RXD | -- | 5 / SCL | 1 / SDA | ++ | -- | 15 / SDA | 14 / SCK | 13 / MOSI | 12 / MISO | NC | GND | NC | 3.3v | EN | TXD | -- | CHPD | VBAT / ++ | Battery | Push to Exit | Servo | RFID (RC522)